# Altium schematic sheet Sheet2.SchDoc
size A4
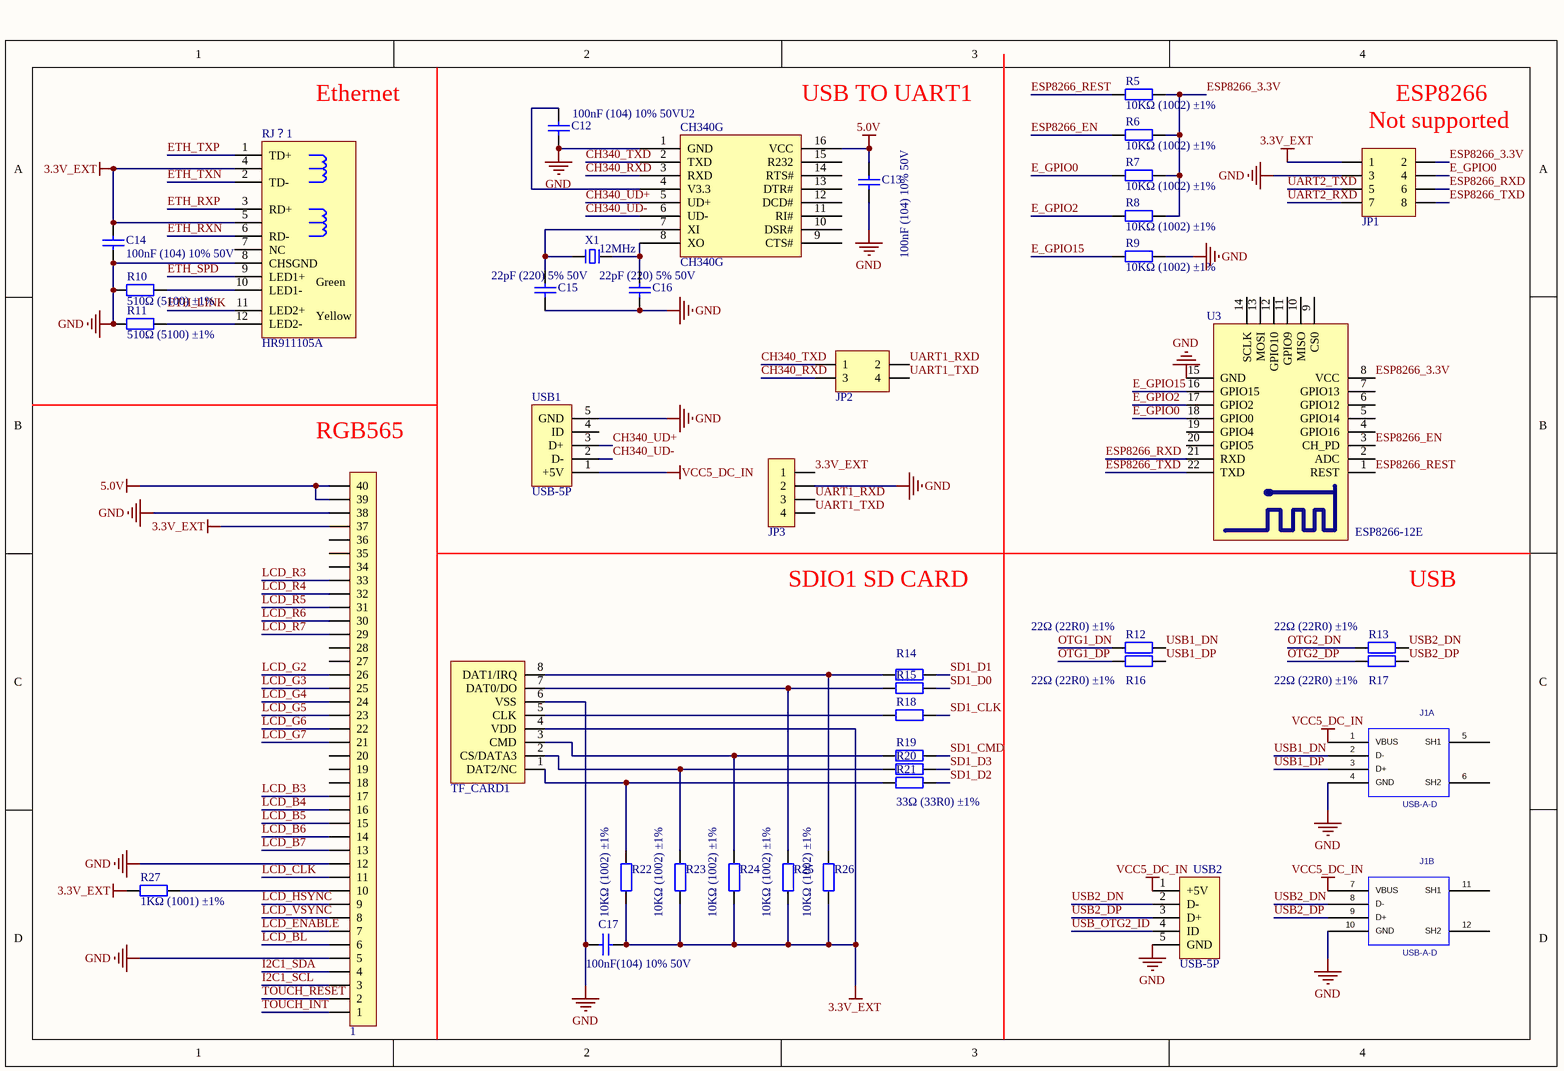
[diagram p0: Sheet2.SchDoc]

## Parts
1  FPC1.0-40P  [FPC0.5 2H-S-W-40P]  (value not drawn)
C12  100nF (104) 10% 50V  [0603_C]
C13  100nF (104) 10% 50V  [0603_C]
C14  100nF (104) 10% 50V  [0603_C]
C15  22pF (220) 5% 50V  [0603_C]
C16  22pF (220) 5% 50V  [0603_C]
C17  100nF(104) 10% 50V  [0805_C]
J1  value USB-A-D  [USB-A-D]  (hidden comment: USB-A-D_0)  (parts A,B of 2)
JP1  Header 4X2  [HDR-4X2]  (value not drawn)
JP2  Header2X2  [HDR-2X2]  (value not drawn)
JP3  HDR-1X4  [HDR-1X4_M]  (value not drawn)
R5  10KΩ (1002) ±1%  [0603_R]
R6  10KΩ (1002) ±1%  [0603_R]
R7  10KΩ (1002) ±1%  [0603_R]
R8  10KΩ (1002) ±1%  [0603_R]
R9  10KΩ (1002) ±1%  [0603_R]
R10  510Ω (5100) ±1%  [0603_R]
R11  510Ω (5100) ±1%  [0603_R]
R12  22Ω (22R0) ±1%  [0603_R]
R13  22Ω (22R0) ±1%  [0603_R]
R14  33Ω (33R0) ±1%  [0603_R]  (value not drawn)
R15  33Ω (33R0) ±1%  [0603_R]  (value not drawn)
R16  22Ω (22R0) ±1%  [0603_R]
R17  22Ω (22R0) ±1%  [0603_R]
R18  33Ω (33R0) ±1%  [0603_R]  (value not drawn)
R19  33Ω (33R0) ±1%  [0603_R]  (value not drawn)
R20  33Ω (33R0) ±1%  [0603_R]  (value not drawn)
R21  33Ω (33R0) ±1%  [0603_R]
R22  10KΩ (1002) ±1%  [0603_R]
R23  10KΩ (1002) ±1%  [0603_R]
R24  10KΩ (1002) ±1%  [0603_R]
R25  10KΩ (1002) ±1%  [0603_R]
R26  10KΩ (1002) ±1%  [0603_R]
R27  1KΩ (1001) ±1%  [0603_R]
RJ？1  HR911105A  [RJ-45A12]
TF_CARD1  SD-MICRO-TF  [SD-MICRO-TF]  (value not drawn)
U2  CH340G  [SOIC-16_150mil]
U3  ESP8266-12E  [ESP_12E]
USB1  USB-5P  [USB-MINI-A]
USB2  USB-5P  [USB-MINI-A]
X1  12MHz  [XTAL-49S DIP]

## Nets
3.3V_EXT: 1.37 C14.2 C17.1 JP1.1 JP3.1 R22.1 R23.1 R24.1 R25.1 R26.1 R27.2 RJ？1.4 RJ？1.5 TF_CARD1.4(VDD)
5.0V: 1.39 1.40 C13.1 U2.16(VCC)
GND: 1.5 1.12 1.38 C12.1 C13.2 C14.1 C15.2 C16.2 C17.2 J1.4(GND) J1.10(GND) JP1.3 JP3.2 R9.1 R10.1 R11.1 RJ？1.8(CHSGND) TF_CARD1.6(VSS) U2.1(GND) U3.15(GND) USB1.5(GND) USB2.5(GND)
VCC5_DC_IN: J1.1(VBUS) J1.7(VBUS) USB1.1(+5V) USB2.1(+5V)
CH340_RXD: JP2.3 U2.3(RXD)
CH340_TXD: JP2.1 U2.2(TXD)
CH340_UD+: U2.5(UD+) USB1.3(D+)
CH340_UD-: U2.6(UD-) USB1.2(D-)
E_GPIO0: JP1.4 R7.1 U3.18(GPIO0)
E_GPIO2: R8.1 U3.17(GPIO2)
E_GPIO15: R9.2 U3.16(GPIO15)
ESP8266_3.3V: JP1.2 R5.2 R6.2 R7.2 R8.2 U3.8(VCC)
ESP8266_EN: R6.1 U3.3(CH_PD)
ESP8266_REST: R5.1 U3.1(REST)
ESP8266_RXD: JP1.6 U3.21(RXD)
ESP8266_TXD: JP1.8 U3.22(TXD)
ETH_LINK: RJ？1.11(LED2+)
ETH_RXN: RJ？1.6(RD-)
ETH_RXP: RJ？1.3(RD+)
ETH_SPD: RJ？1.9(LED1+)
ETH_TXN: RJ？1.2(TD-)
ETH_TXP: RJ？1.1(TD+)
I2C1_SCL: 1.3
I2C1_SDA: 1.4
LCD_B3: 1.17
LCD_B4: 1.16
LCD_B5: 1.15
LCD_B6: 1.14
LCD_B7: 1.13
LCD_BL: 1.6
LCD_CLK: 1.11
LCD_ENABLE: 1.7
LCD_G2: 1.26
LCD_G3: 1.25
LCD_G4: 1.24
LCD_G5: 1.23
LCD_G6: 1.22
LCD_G7: 1.21
LCD_HSYNC: 1.9
LCD_R3: 1.33
LCD_R4: 1.32
LCD_R5: 1.31
LCD_R6: 1.30
LCD_R7: 1.29
LCD_VSYNC: 1.8
OTG1_DN: R12.1
OTG1_DP: R16.1
OTG2_DN: R13.1
OTG2_DP: R17.1
SD1_CLK: R18.2
SD1_CMD: R19.2
SD1_D0: R15.2
SD1_D1: R14.2
SD1_D2: R21.2
SD1_D3: R20.2
TOUCH_INT: 1.1
TOUCH_RESET: 1.2
UART1_RXD: JP2.2 JP3.3
UART1_TXD: JP2.4 JP3.4
UART2_RXD: JP1.7
UART2_TXD: JP1.5
USB1_DN: J1.2(D-) R12.2
USB1_DP: J1.3(D+) R16.2
USB2_DN: J1.8(D-) R13.2 USB2.2(D-)
USB2_DP: J1.9(D+) R17.2 USB2.3(D+)
USB_OTG2_ID: USB2.4(ID)
Net1_10: 1.10 R27.1
NetC12_2: C12.2 U2.4(V3.3)
NetC15_1: C15.1 U2.7(XI) X1.1
NetC16_1: C16.1 U2.8(XO) X1.2
NetR10_2: R10.2 RJ？1.10(LED1-)
NetR11_2: R11.2 RJ？1.12(LED2-)
NetR14_1: R14.1 R26.2 TF_CARD1.8(DAT1/IRQ)
NetR15_1: R15.1 R25.2 TF_CARD1.7(DAT0/DO)
NetR18_1: R18.1 TF_CARD1.5(CLK)
NetR19_1: R19.1 R24.2 TF_CARD1.3(CMD)
NetR20_1: R20.1 R23.2 TF_CARD1.2(CS/DATA3)
NetR21_1: R21.1 R22.2 TF_CARD1.1(DAT2/NC)

Not connected (* = marked no-connect by the designer): 1 18 19 20 27 28 34 35 36; J1 5(SH1) 6(SH2) 11(SH1) 12(SH2); RJ？1 7(NC); U2 9(CTS#) 10(DSR#) 11(RI#) 12(DCD#) 13(DTR#) 14(RTS#) 15(R232); U3 2(ADC) 4(GPIO16) 5(GPIO14) 6(GPIO12) 7(GPIO13) 9(CS0) 10(MISO) 11(GPIO9) 12(GPIO10) 13(MOSI) 14(SCLK) 19(GPIO4) 20(GPIO5); USB1 4(ID)

## Notes on the sheet
- Ethernet
- (near U2) USB TO UART1
- (near JP1) Not supported
- ESP8266
- (near 1) RGB565
- SDIO1 SD CARD
- USB
- Title
- Size:
- Date:
- A4
- Number:
- Time:
- Revision:
- Sheet
- of
- File:
- (in symbol HR911105A) Green; Yellow

## Library data of the parts
1 = FPC-40P: FPC连接器; 版权归属: 源创客; BOM名称: FPC连接器; 学习资源: www.ooocke.com
C12-C14 = 0603 100nF (104) 10% 50V: 贴片电容; ComponentLink1Description: 供应商链接; ComponentLink1URL: http://www.szlcsc.com/product/details_15331.html; Package: 0603; Supplier: LC; SuppliersPartNumber: C14663
C15 C16 = 0805 22pF (220) 5% 50V: 贴片电容; ComponentLink1Description: 供应商链接; ComponentLink1URL: http://www.szlcsc.com/product/details_2156.html; Package: 0805; Supplier: LC; SuppliersPartNumber: C1804
C17 = 0805 100nF(104) 10% 50V: 贴片电容; ComponentLink1Description: 供应商链接; ComponentLink1URL: http://www.szlcsc.com/product/details_50686.html; Package: 0805; Supplier: LC; SuppliersPartNumber: C49678
J1 = USB-A-D_0: Source_Path: D:\NXP_RT1050\RT1050_MB_PRO\SCH\IMXRT1052_MB_PRO_0313.DSN; PCB DECAL: USB-A-D
JP1 = Header 4X2: 4*2P接插件; 版权归属: 源创客; BOM名称: 4*2P接插件; 学习资源: www.ooocke.com
JP2 = Header 2X2: 2*2P接插件; 版权归属: 源创客; BOM名称: 2*2P接插件; 学习资源: www.ooocke.com
JP3 = Header 4: 4P接插件; 版权归属: 源创客; BOM名称: 4P接插件; 学习资源: www.ooocke.com
R5-R9 R22-R26 = 0603 10KΩ (1002) 1%: 贴片电阻; ComponentLink1Description: 供应商链接; ComponentLink1URL: http://www.szlcsc.com/product/details_26547.html; Package: 0603; Supplier: LC; SuppliersPartNumber: C25804
R10 R11 = 0603 510Ω (5100) 1%: 贴片电阻; ComponentLink1Description: 供应商链接; ComponentLink1URL: http://www.szlcsc.com/product/details_23920.html; Package: 0603; Supplier: LC; SuppliersPartNumber: C23193
R12 R13 R16 R17 = 0603 22Ω (22R0) 1%: 贴片电阻; ComponentLink1Description: 供应商链接; ComponentLink1URL: http://www.szlcsc.com/product/details_24078.html; Package: 0603; Supplier: LC; SuppliersPartNumber: C23345
R14 R15 R18-R21 = 0603 33Ω (33R0) 1%: 贴片电阻; ComponentLink1Description: 供应商链接; ComponentLink1URL: http://www.szlcsc.com/product/details_23867.html; Package: 0603; Supplier: LC; SuppliersPartNumber: C23140
R27 = 0603 1KΩ (1001) 1%: 贴片电阻; ComponentLink1Description: 供应商链接; ComponentLink1URL: http://www.szlcsc.com/product/details_21904.html; Package: 0603; Supplier: LC; SuppliersPartNumber: C21190
RJ？1 = HR911105A: 带灯以太网接口; 版权归属: 源创客; BOM名称: 带灯以太网接口; 学习资源: www.ooocke.com
TF_CARD1 = SD-MICRO-TF: SD,MICRO,TF
U2 = CH340G_[C14267]: USB; ComponentLink1Description: 供应商链接; ComponentLink1URL: http://www.szlcsc.com/product/details_14927.html; Package: SOIC-16_150mil; Supplier: LC; SuppliersPartNumber: C14267
U3 = ESP8266-12E: 串口 WIFI模块，ESP-12E; BOM名称: WIFI模块; 版权归属: 源创客; 学习资源: www.ooocke.com
USB1 USB2 = USB-5P: 微型USB母座; 版权归属: 源创客; BOM名称: 微型USB母座; 学习资源: www.ooocke.com
X1 = XTAL-2: 2脚晶振; 版权归属: 源创客; BOM名称: 2脚晶振; 学习资源: www.ooocke.com